# EAGLE design OuterConnector (EAGLE 6.6.0)
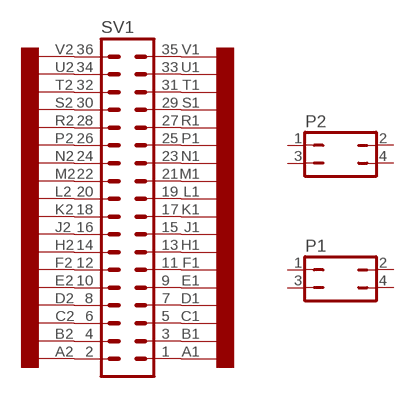
[diagram p0: schematic, sheet 1]

## Parts
P1  JP2Q  [JP2Q]
P2  JP2Q  [JP2Q]
SV1  MA18-2  [MA18-2]
U$1  EDGE-2CONNECTOR  [EDGE-CON2]

## Nets
N$1: SV1.36 U$1.V2
N$2: SV1.34 U$1.U2
N$3: SV1.32 U$1.T2
N$4: SV1.30 U$1.S2
N$5: SV1.28 U$1.R2
N$6: SV1.26 U$1.P2
N$7: SV1.24 U$1.N2
N$8: SV1.22 U$1.M2
N$9: SV1.20 U$1.L2
N$10: SV1.18 U$1.K2
N$11: SV1.16 U$1.J2
N$12: SV1.14 U$1.H2
N$13: SV1.12 U$1.F2
N$14: SV1.10 U$1.E2
N$15: SV1.8 U$1.D2
N$16: SV1.6 U$1.C2
N$17: SV1.4 U$1.B2
N$18: SV1.2 U$1.A2
N$19: SV1.35 U$1.V1
N$20: SV1.33 U$1.U1
N$21: SV1.31 U$1.T1
N$22: SV1.29 U$1.S1
N$23: SV1.27 U$1.R1
N$24: SV1.25 U$1.P1
N$25: SV1.23 U$1.N1
N$26: SV1.21 U$1.M1
N$27: SV1.19 U$1.L1
N$28: SV1.17 U$1.K1
N$29: SV1.15 U$1.J1
N$30: SV1.13 U$1.H1
N$31: SV1.11 U$1.F1
N$32: SV1.9 U$1.E1
N$33: SV1.7 U$1.D1
N$34: SV1.5 U$1.C1
N$35: SV1.3 U$1.B1
N$36: SV1.1 U$1.A1
Unconnected: P1.1 P1.2 P1.3 P1.4 P2.1 P2.2 P2.3 P2.4

## Library data of the parts
P1 P2 = dec-con:JP2Q: JUMPER
SV1 = con-lstb:MA18-2: PIN HEADER; OC_FARNELL: unknown; OC_NEWARK: unknown
U$1 = dec-con:EDGE-2: Double-Sided DEC edge connector.

## Net classes
0 default: width 0.508 mm

## Board
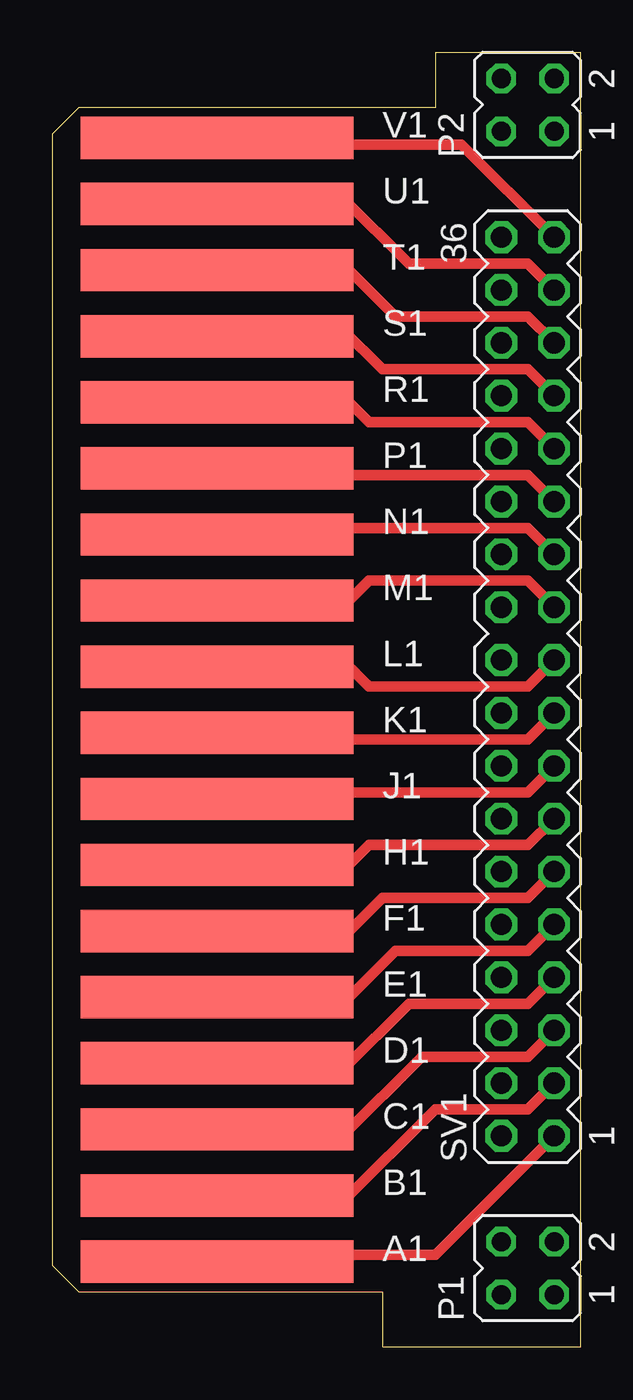
[diagram p1: board, top side]
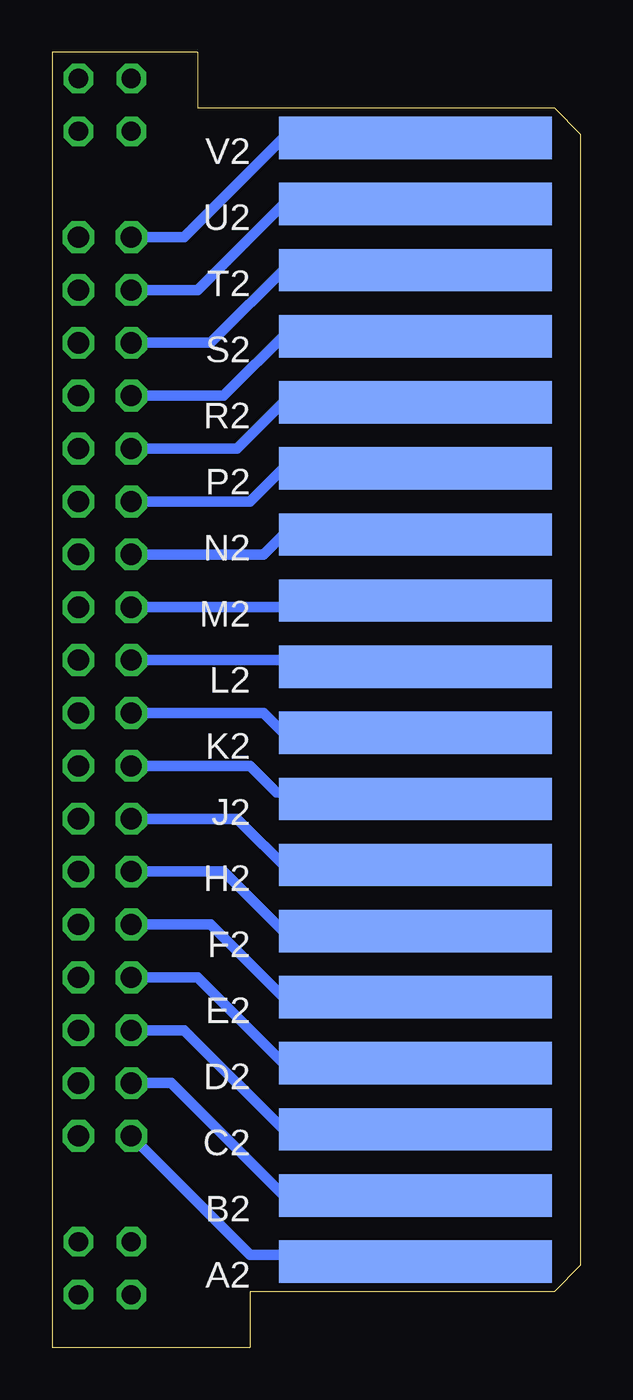
[diagram p2: board, bottom side, seen from below]

Size 25.4 x 62.23 mm. Coordinates in mm from the lower left corner, seen from the top.
Outline: 15.88,0 25.4,0 25.4,62.23 18.41,62.23 18.41,59.69
Copper layers (1+16): Top 0.035mm / dielectric 1.5mm / Bottom 0.035mm
Design rules "16mils": minimum track width 16mil, minimum drill 32mil, track to track 15mil, track to pad 10mil, pad to pad 10mil, via to via 10mil, smd to smd 10mil, copper to edge 13mil, drill to drill 10mil, minimum pad ring 10mil, minimum via ring 8mil, stop-mask expansion 0mil, vias tented up to drill 0mil, thermal gap 10mil

### Footprints (pad centres in the part's own frame; a part is rotated, then mirrored left to right if it is on the bottom)
JP2Q = drill 0.914 octagon: 1 -1.27,-1.27; 2 -1.27,1.27; 3 1.27,-1.27; 4 1.27,1.27
MA18-2 = drill 1.016 octagon: 1 -21.59,-1.27; 2 -21.59,1.27; 3 -19.05,-1.27; 4 -19.05,1.27; 5 -16.51,-1.27; 6 -16.51,1.27; 7 -13.97,-1.27; 8 -13.97,1.27; 9 -11.43,-1.27; 10 -11.43,1.27; 11 -8.89,-1.27; 12 -8.89,1.27; 13 -6.35,-1.27; 14 -6.35,1.27; 15 -3.81,-1.27; 16 -3.81,1.27; 17 -1.27,-1.27; 18 -1.27,1.27; 19 1.27,-1.27; 20 1.27,1.27; 21 3.81,-1.27; 22 3.81,1.27; 23 6.35,-1.27; 24 6.35,1.27; 25 8.89,-1.27; 26 8.89,1.27; 27 11.43,-1.27; 28 11.43,1.27; 29 13.97,-1.27; 30 13.97,1.27; 31 16.51,-1.27; 32 16.51,1.27; 33 19.05,-1.27; 34 19.05,1.27; 35 21.59,-1.27; 36 21.59,1.27
EDGE-CON2 = smd 13.106 x 2.032: A1 7.938,4.128; B1 7.938,7.303; C1 7.938,10.477; D1 7.938,13.652; E1 7.938,16.828; F1 7.938,20.003; H1 7.938,23.177; J1 7.938,26.352; K1 7.938,29.527; L1 7.938,32.703; M1 7.938,35.877; N1 7.938,39.053; P1 7.938,42.227; R1 7.938,45.403; S1 7.938,48.578; T1 7.938,51.752; U1 7.938,54.928; V1 7.938,58.102 | smd 13.106 x 2.032 bottom: A2 7.938,4.128; B2 7.938,7.303; C2 7.938,10.477; D2 7.938,13.652; E2 7.938,16.828; F2 7.938,20.003; H2 7.938,23.177; J2 7.938,26.352; K2 7.938,29.527; L2 7.938,32.703; M2 7.938,35.877; N2 7.938,39.053; P2 7.938,42.227; R2 7.938,45.403; S2 7.938,48.578; T2 7.938,51.752; U2 7.938,54.928; V2 7.938,58.102

### Placement (x,y rotation side)
P1  22.86,3.81 90 top
P2  22.86,59.69 90 top
SV1  22.86,31.75 90 top
U$1  0,0 0 top

### Tracks (layer width: path | path; a pad name or v marks a point on that pad's centre or on a via)
N$1
  Bottom 0.508: SV1.36 19.05,53.34 13.97,58.42 U$1.V2
N$2
  Bottom 0.508: SV1.34 18.41,50.8 13.97,55.24 U$1.U2
N$3
  Bottom 0.508: SV1.32 17.78,48.26 13.97,52.07 U$1.T2
N$4
  Bottom 0.508: SV1.30 17.14,45.72 13.97,48.9 U$1.S2
N$5
  Bottom 0.508: SV1.28 16.51,43.18 13.97,45.72 U$1.R2
N$6
  Bottom 0.508: SV1.26 15.88,40.64 13.97,42.55 U$1.P2
N$7
  Bottom 0.508: SV1.24 15.24,38.1 13.97,39.37 U$1.N2
N$8
  Bottom 0.508: SV1.22 13.97,35.56 U$1.M2
N$9
  Bottom 0.508: SV1.20 13.97,33.02 U$1.L2
N$10
  Bottom 0.508: SV1.18 15.24,30.48 13.97,29.21 U$1.K2
N$11
  Bottom 0.508: SV1.16 15.88,27.94 14.61,26.67 U$1.J2
N$12
  Bottom 0.508: SV1.14 16.51,25.4 13.97,22.86 U$1.H2
N$13
  Bottom 0.508: SV1.12 17.14,22.86 13.97,19.68 U$1.F2
N$14
  Bottom 0.508: SV1.10 17.78,20.32 13.97,16.51 U$1.E2
N$15
  Bottom 0.508: SV1.8 18.41,17.78 13.97,13.34 U$1.D2
N$16
  Bottom 0.508: SV1.6 19.05,15.24 13.97,10.16 U$1.C2
N$17
  Bottom 0.508: SV1.4 19.68,12.7 13.97,6.99 U$1.B2
N$18
  Bottom 0.508: SV1.2 15.88,4.45 13.34,4.45 U$1.A2
N$19
  Top 0.508: SV1.35 19.68,57.78 13.34,57.78 U$1.V1
N$20
  Top 0.508: SV1.33 22.86,52.07 17.14,52.07 13.97,55.24 U$1.U1
N$21
  Top 0.508: SV1.31 22.86,49.53 16.51,49.53 13.97,52.07 U$1.T1
N$22
  Top 0.508: SV1.29 22.86,46.99 15.88,46.99 13.97,48.9 U$1.S1
N$23
  Top 0.508: SV1.27 22.86,44.45 15.24,44.45 13.97,45.72 U$1.R1
N$24
  Top 0.508: SV1.25 22.86,41.91 13.97,41.91 U$1.P1
N$25
  Top 0.508: SV1.23 22.86,39.37 13.97,39.37 U$1.N1
N$26
  Top 0.508: SV1.21 22.86,36.83 15.24,36.83 13.97,35.56 U$1.M1
N$27
  Top 0.508: SV1.19 22.86,31.75 15.24,31.75 13.97,33.02 U$1.L1
N$28
  Top 0.508: SV1.17 22.86,29.21 13.97,29.21 U$1.K1
N$29
  Top 0.508: SV1.15 22.86,26.67 13.97,26.67 U$1.J1
N$30
  Top 0.508: SV1.13 22.86,24.13 15.24,24.13 13.97,22.86 U$1.H1
N$31
  Top 0.508: SV1.11 22.86,21.59 15.88,21.59 13.97,19.68 U$1.F1
N$32
  Top 0.508: SV1.9 22.86,19.05 16.51,19.05 13.97,16.51 U$1.E1
N$33
  Top 0.508: SV1.7 22.86,16.51 17.14,16.51 13.97,13.34 U$1.D1
N$34
  Top 0.508: SV1.5 22.86,13.97 17.78,13.97 13.97,10.16 U$1.C1
N$35
  Top 0.508: SV1.3 22.86,11.43 18.41,11.43 13.97,6.99 U$1.B1
N$36
  Top 0.508: SV1.1 18.41,4.45 13.97,4.45 U$1.A1